# Altium project Buzzer.PrjPcb
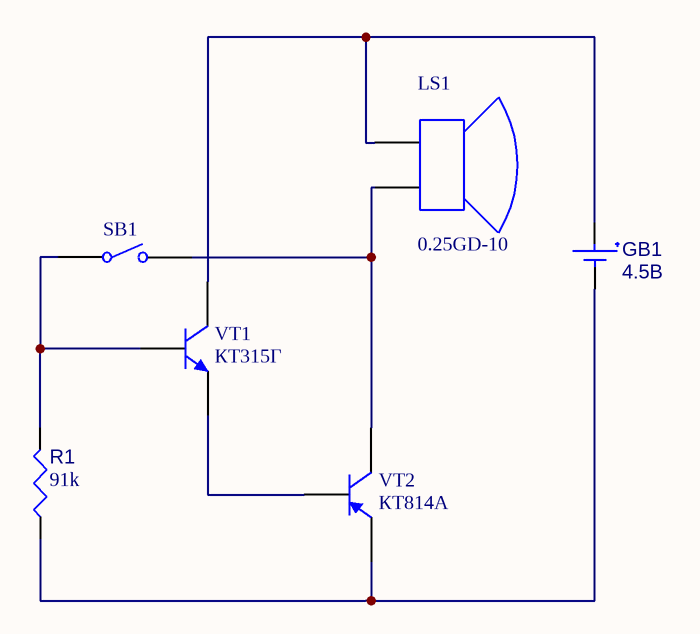
[diagram p0: Buzzer.SchDoc]
1 sheet, 6 parts. Net scope: global (net labels, ports and power ports of the same name join across sheets).
Board file: Buzzer.PcbDoc

## Sheet Buzzer.SchDoc
size A4; SheetNumber: 1; SheetTotal: 1

### Parts
GB1  4.5B  [SEIK-MS621FE-FL11E-2_V]
LS1  0.25GD-10  [ADAI-ADA1898]
R1  value 91k  [RESC0805(2012)_L]  (hidden comment: 1KR5J)
SB1  B3U-3000P  [OMRON-B3U-3000P_V]  (value not drawn)
VT1  КТ315Г  [JSCJ-TO-92-3_V]
VT2  КТ814А  [UNIC-TO-92-3]

### Nets
NetGB1_1: GB1.1(+) LS1.1(+) VT1.3(C)
NetGB1_2: GB1.2(-) R1.1 VT2.1(E)
NetLS1_2: LS1.2(-) SB1.2 VT2.3(C)
NetR1_2: R1.2 SB1.1 VT1.2(B)
NetVT1_1: VT1.1(E) VT2.2(B)

### Library data of the parts
GB1 = CMP-00029-00000-1: MS Lihium Rechargeable Battery, 3 V, -20 to 60 degC, Tray; RoHS Compliant: NotApplicable; Mounting Technology: WithLeads; Pins: 2
LS1 = CMP-00027-00000-1: Mini Speaker, 8 Ohm, 0.2 Wmax, -10 to 40 degC, 2-Pin THD, RoHS; Manufacturer: Adafruit Industries; Mounting Technology: TH; Datasheet URL: https://cdn-shop.adafruit.com/datasheets/P1898.pdf; Package Description: 2-Pin Through Hole Device, Dia 29.3 mm, Pitch 15 mm; Case/Package: ADA1898; Package Reference: ADA1898; Datasheet Version: Mar-14; Manufacturer URL: https://www.adafruit.com/; RoHS Compliant: Unknown
R1 = CMP-009-00076-2: 1K 0.125W 5% 0805 (2012 Metric)  SMD; Power: 125mW; Pins: 2; Mounting Technology: SMT; Tolerance: 5%; Case/Package: 0805
SB1 = CMP-011-00005-2: Tactile Switch, SPST-NO, 0.05 A, 12 V, -25 to 70 degC, 2-Pin SMD, RoHS, Tape and Reel; Manufacturer: Omron Electronic Components; Operating Force: 162gf; Voltage Rating (DC): 12V; Current Rating: 50mA; IP Rating: IP40; Throw Configuration: SPST; Max Contact Resistance: 100mohm; RoHS Compliant: True; Contact Current Rating: 50mA; Manufacturer URL: http://www.omron.com/; Packaging: TapeandReel; Max Voltage Rating (DC): 12V; Contact Material: Silver; Datasheet Version: Jan-15; Package Reference: B3U-3000P; Package Description: 2-Pin Surface Mount Device, Body 4 x 3.2 mm; Min Operating Temperature: -25°C; Package Quantity: 4000; Max Operating Temperature: 70°C; Max Current Rating: 50mA; Voltage Rating: 12V; Case/Package: B3U-3000P; Mounting Technology: SM; Datasheet URL: https://www.omron.com/ecb/products/pdf/en-b3u.pdf
VT1 = CMP-013-00000-3: Transistor, NPN, 0.1 uA, 150 MHz, 3-Pin TO-92; Manufacturer: Jiangsu Changjiang Electronics Technology; Case/Package: TO-92-3; Datasheet URL: http://www.cj-elec.com/txUpfile/20121910315050632.pdf; Datasheet Version: Rev. B, 11/2011; Package Description: 3-Pin Through Hole Device, Height 4.7 mm, Pitch 2.3 mm; Mounting Technology: TH; RoHS Compliant: False; Package Reference: TO-92-3
VT2 = CMP-013-00004-3: Low Voltage High Current Small Signal PNP Transistor, 20 V, 700 mA, 3-Pin TO-92, RoHS; Manufacturer: Unisonic; Mounting Technology: TH; Package Description: 3-Pin Through Hole Device, Dia 4.58 mm, Pitch 1.27 mm; Datasheet URL: http://media.nkcelectronics.com/datasheet/s8550.pdf; Case/Package: TO-92-3; Datasheet Version: Rev. E, 06/2014; Package Reference: TO-92-3; RoHS Compliant: Unknown